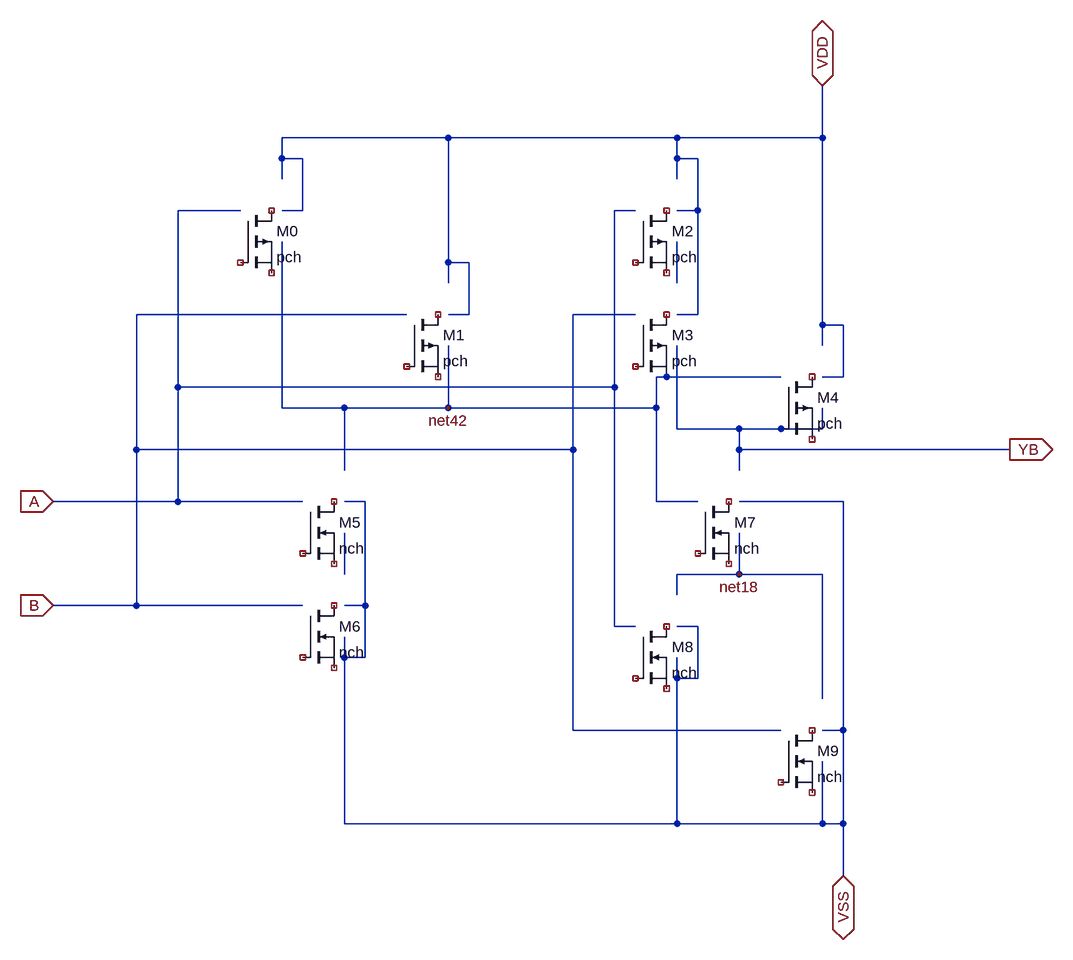
[diagram p0: schematic exnr.asc]
exnr.asc, the LTspice schematic file:
Version 4
SHEET 1 1648 1408
WIRE 1152 656 1568 656
WIRE 1152 656 1152 624
WIRE 1152 688 1152 656
WIRE 1152 624 1280 624
WIRE 1280 624 1280 592
WIRE 1056 624 1152 624
WIRE 1056 624 1056 496
WIRE 1056 400 1056 336
WIRE 1312 1088 1312 736
WIRE 1152 736 1312 736
WIRE 544 736 576 736
WIRE 576 896 576 736
WIRE 544 976 576 976
WIRE 544 976 544 944
WIRE 576 976 576 896
WIRE 544 896 576 896
WIRE 1280 1232 1280 1136
WIRE 1056 1232 1056 1008
WIRE 1312 1232 1312 1088
WIRE 1280 1088 1312 1088
WIRE 1280 1232 1312 1232
WIRE 1056 1008 1088 1008
WIRE 1056 1008 1056 976
WIRE 1088 1008 1088 928
WIRE 1056 928 1088 928
WIRE 544 1232 1056 1232
WIRE 1312 1312 1312 1232
WIRE 1056 1232 1280 1232
WIRE 544 1232 544 976
WIRE 1152 848 1152 784
WIRE 1152 848 1280 848
WIRE 1280 1040 1280 848
WIRE 1056 848 1152 848
WIRE 1056 880 1056 848
WIRE 224 656 896 656
WIRE 896 656 896 448
WIRE 224 656 224 448
WIRE 224 896 480 896
WIRE 224 896 224 656
WIRE 96 896 224 896
WIRE 224 448 640 448
WIRE 896 448 992 448
WIRE 896 1088 896 656
WIRE 896 1088 1216 1088
WIRE 544 848 544 784
WIRE 704 592 1024 592
WIRE 1024 736 1088 736
WIRE 1024 736 1024 592
WIRE 1024 592 1024 544
WIRE 1024 544 1216 544
WIRE 544 592 704 592
WIRE 448 592 544 592
WIRE 704 592 704 496
WIRE 448 592 448 336
WIRE 544 688 544 592
WIRE 1280 176 1280 96
WIRE 704 176 1056 176
WIRE 1280 464 1312 464
WIRE 1280 464 1280 176
WIRE 1312 544 1312 464
WIRE 1280 544 1312 544
WIRE 1056 288 1088 288
WIRE 1088 288 1088 208
WIRE 1056 208 1088 208
WIRE 1056 208 1056 176
WIRE 1088 448 1088 288
WIRE 1056 448 1088 448
WIRE 704 448 736 448
WIRE 736 448 736 368
WIRE 704 368 736 368
WIRE 704 368 704 176
WIRE 448 208 480 208
WIRE 448 208 448 176
WIRE 480 288 480 208
WIRE 448 288 480 288
WIRE 1280 496 1280 464
WIRE 1056 240 1056 208
WIRE 1056 176 1280 176
WIRE 704 400 704 368
WIRE 448 176 704 176
WIRE 448 240 448 208
WIRE 288 560 960 560
WIRE 960 560 960 288
WIRE 288 560 288 288
WIRE 288 288 384 288
WIRE 288 736 288 560
WIRE 288 736 480 736
WIRE 96 736 288 736
WIRE 960 928 992 928
WIRE 960 928 960 560
WIRE 960 288 992 288
FLAG 1152 848 net18
FLAG 704 592 net42
SYMBOL NMOS 1216 1088 R0
SYMATTR InstName M9
SYMATTR Value nch
SYMATTR Value2 w=2u l=1u
SYMBOL NMOS 992 928 R0
SYMATTR InstName M8
SYMATTR Value nch
SYMATTR Value2 w=2u l=1u
SYMBOL NMOS 1088 736 R0
SYMATTR InstName M7
SYMATTR Value nch
SYMATTR Value2 w=2u l=1u
SYMBOL NMOS 480 896 R0
SYMATTR InstName M6
SYMATTR Value nch
SYMATTR Value2 w=2u l=1u
SYMBOL NMOS 480 736 R0
SYMATTR InstName M5
SYMATTR Value nch
SYMATTR Value2 w=2u l=1u
SYMBOL PMOS 1216 544 R0
SYMATTR InstName M4
SYMATTR Value pch
SYMATTR Value2 w=6u l=1u
SYMBOL PMOS 992 448 R0
SYMATTR InstName M3
SYMATTR Value pch
SYMATTR Value2 w=6u l=1u
SYMBOL PMOS 992 288 R0
SYMATTR InstName M2
SYMATTR Value pch
SYMATTR Value2 w=6u l=1u
SYMBOL PMOS 640 448 R0
SYMATTR InstName M1
SYMATTR Value pch
SYMATTR Value2 w=6u l=1u
SYMBOL PMOS 384 288 R0
SYMATTR InstName M0
SYMATTR Value pch
SYMATTR Value2 w=6u l=1u
FLAG 1568 656 YB
IOPIN 1568 656 Out
FLAG 1312 1312 VSS
IOPIN 1312 1312 BiDir
FLAG 1280 96 VDD
IOPIN 1280 96 BiDir
FLAG 96 896 B
IOPIN 96 896 In
FLAG 96 736 A
IOPIN 96 736 In

The netlist it stands for:
* exnr.asc
* M9: nch w=2u l=1u (symbol NMOS not certain, pin order unknown); nets seen at it: 
* M8: nch w=2u l=1u (symbol NMOS not certain, pin order unknown); nets seen at it: 
* M7: nch w=2u l=1u (symbol NMOS not certain, pin order unknown); nets seen at it: 
* M6: nch w=2u l=1u (symbol NMOS not certain, pin order unknown); nets seen at it: 
* M5: nch w=2u l=1u (symbol NMOS not certain, pin order unknown); nets seen at it: 
* M4: pch w=6u l=1u (symbol PMOS not certain, pin order unknown); nets seen at it: YB
* M3: pch w=6u l=1u (symbol PMOS not certain, pin order unknown); nets seen at it: net42
* M2: pch w=6u l=1u (symbol PMOS not certain, pin order unknown); nets seen at it: 
* M1: pch w=6u l=1u (symbol PMOS not certain, pin order unknown); nets seen at it: 
* M0: pch w=6u l=1u (symbol PMOS not certain, pin order unknown); nets seen at it: 
.backanno
.end